# Altium schematic sheet PCB_RGBlimp-Q_Subplate.schdoc
size 302 x 215 mm; Name: A_A4; Symbol: A_A4; Device: A_A4; @Project Name: Subplate; REV: 1.0; Date: 2023-11-15; Sheet: 1/1; Draw By: rgblimp; Company: PKU; Convert to PCB: yes; Add into BOM: yes
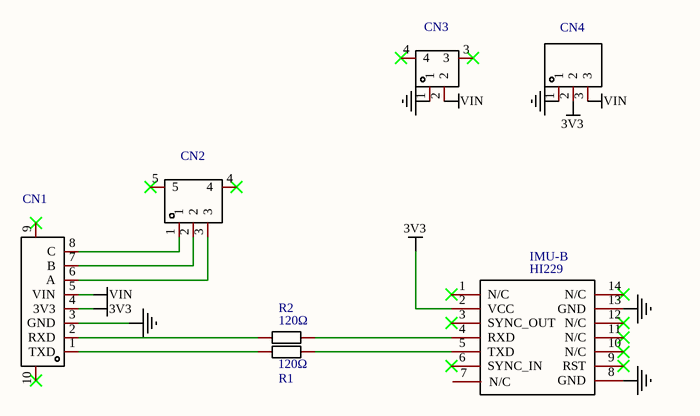
[diagram p0: PCB_RGBlimp-Q_Subplate.schdoc]

## Parts
CN1  AFC12-S08CCC-00  [CONN-SMD_8P-P1.25-V-M_AFC12-S08CCC-00-TAOBAO]  (value not drawn)
CN2  AFC12-S03CCC-00  [CONN-SMD_AFC12-S03CCC-00]  (value not drawn)
CN3  AFC12-S02CCC-00  [CONN-SMD_AFC12-S02CCC-00]  (value not drawn)
CN4  A2005WV-3P  [HDR-TH_3P-P2.00-V-M]  (value not drawn)
IMU-B  HI229  [HI229]
R1  120Ω  [R0603]
R2  120Ω  [R0603]

## Nets
3V3: CN1.4(3V3) CN4.2 IMU-B.2(VCC)
GND: CN1.3(GND) CN3.1 CN4.1 IMU-B.8(GND) IMU-B.13(GND)
VIN: CN1.5(VIN) CN3.2 CN4.3
NetCN1_1: CN1.1(TXD) R1.1
NetCN1_2: CN1.2(RXD) R2.1
NetCN1_6: CN1.6(A) CN2.3
NetCN1_7: CN1.7(B) CN2.2
NetCN1_8: CN1.8(C) CN2.1
NetIMU-B_4: IMU-B.4(RXD) R2.2
NetIMU-B_5: IMU-B.5(TXD) R1.2

Not connected (* = marked no-connect by the designer): CN1 9* 10*; CN2 4* 5*; CN3 3* 4*; IMU-B 1(N/C)* 3(SYNC_OUT)* 6(SYNC_IN)* 7(N/C) 9(RST)* 10(N/C)* 11(N/C)* 12(N/C)* 14(N/C)*

## Notes on the sheet
- 1
- 2
- 3
- 4
- 5
- A
- B
- C
- D
- TITLE:
- Subplate
- REV:
- 1.0
- Date:
- Company:
- 2023-11-15
- PKU
- Drawn By:
- rgblimp
- Sheet:
- 1/1

## Library data of the parts
CN1 = AFC12-S08CCC-00: Manufacturer: JS(钜硕电子); Convert to PCB: yes; Name: AFC12-S08CCC-00; Symbol: AFC12-S08CCC-00; Device: AFC12-S08CCC-00; Supplier: LCSC; Supplier Part: C395349; Manufacturer Part: AFC12-S08CCC-00; JLCPCB Part Class: Extended Part; link: https://so.szlcsc.com/global.html?k=C395349&amp;ref=editor; Add into BOM: yes; Origin Footprint: CONN-SMD_8P-P1.25-V-M_AFC12-S08CCC-00-TAOBAO
CN2 = AFC12-S03CCC-00: Manufacturer: JS(钜硕电子); Convert to PCB: yes; Name: AFC12-S03CCC-00; Symbol: AFC12-S03CCC-00; Device: AFC12-S03CCC-00; Supplier: LCSC; Supplier Part: C395344; Manufacturer Part: AFC12-S03CCC-00; JLCPCB Part Class: Extended Part; link: https://so.szlcsc.com/global.html?k=C395344&amp;ref=editor; Add into BOM: yes; Origin Footprint: CONN-SMD_AFC12-S03CCC-00
CN3 = AFC12-S02CCC-00: Manufacturer: JS(钜硕电子); Convert to PCB: yes; Name: AFC12-S02CCC-00; Symbol: AFC12-S02CCC-00; Device: AFC12-S02CCC-00; Supplier: LCSC; Supplier Part: C395343; Manufacturer Part: AFC12-S02CCC-00; JLCPCB Part Class: Extended Part; link: https://so.szlcsc.com/global.html?k=C395343&amp;ref=editor; Add into BOM: yes; Origin Footprint: CONN-SMD_AFC12-S02CCC-00
CN4 = A2005WV-3P: Manufacturer: CJT(长江连接器); Convert to PCB: yes; Name: A2005WV-3P; Symbol: A2005WV-3P; Device: A2005WV-3P; Supplier: LCSC; Supplier Part: C225255; Manufacturer Part: A2005WV-3P; JLCPCB Part Class: Extended Part; link: https://so.szlcsc.com/global.html?k=C225255&amp;ref=editor; Add into BOM: yes; Origin Footprint: HDR-TH_3P-P2.00-V-M
IMU-B = HI229: Convert to PCB: yes; Name: HI229; Symbol: HI229; Device: HI229; Add into BOM: yes; Origin Footprint: HI229
R1 R2 = 120Ω: Manufacturer: UNI-ROYAL(厚声); Manufacturer Part: 0603WAF1200T5E; Convert to PCB: yes; Name: 120Ω; Symbol: 120Ω; Device: 120Ω; Supplier: LCSC; Supplier Part: C22787; JLCPCB Part Class: Basic Part; link: https://so.szlcsc.com/global.html?k=C22787&amp;ref=editor; Add into BOM: yes; Origin Footprint: R0603